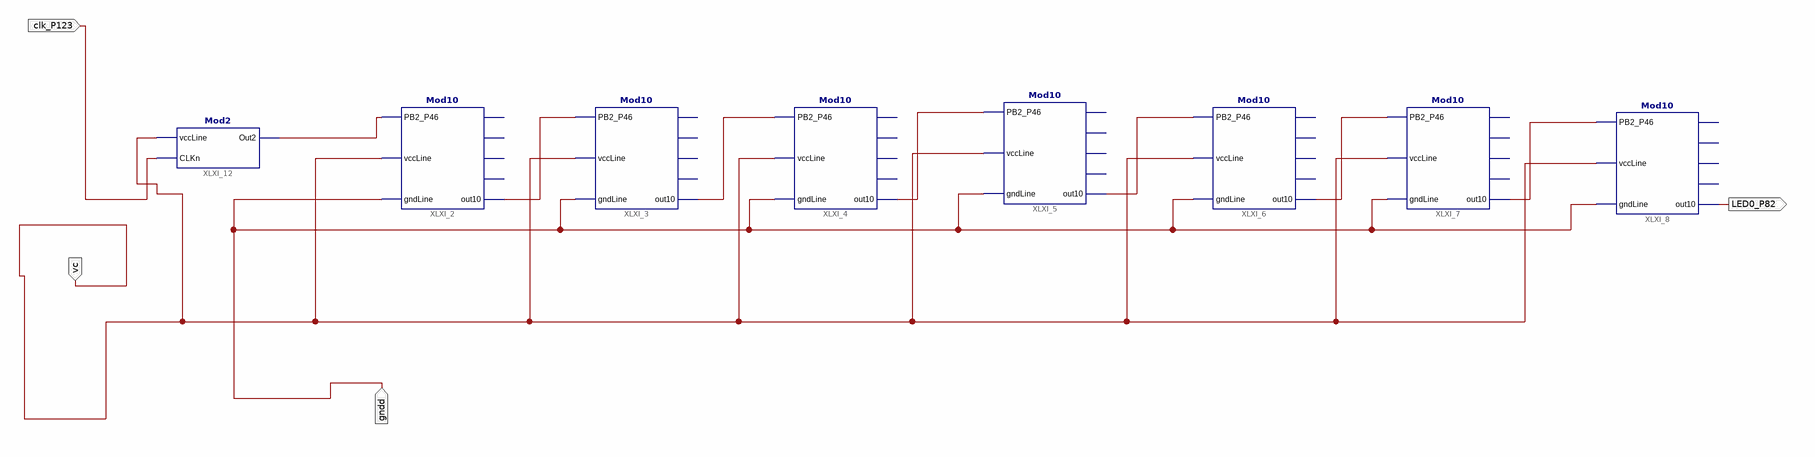
[diagram p0: schematic sheet 1]
// Xilinx ISE schematic time1s.sch (spartan6) as structural Verilog: 8 symbols, 4 ports
module time1s (
  input  gndd,
  input  clk_P123,
  input  vc,
  output LED0_P82
);

  wire XLXN_2, XLXN_3, XLXN_4, XLXN_5, XLXN_6, XLXN_7, XLXN_15;

  Mod10 XLXI_2 (.PB2_P46(XLXN_15), .vccLine(vc), .gndLine(gndd), .out10(XLXN_2));  // open: A, B, C, D
  Mod10 XLXI_3 (.PB2_P46(XLXN_2), .vccLine(vc), .gndLine(gndd), .out10(XLXN_3));  // open: A, B, C, D
  Mod10 XLXI_4 (.PB2_P46(XLXN_3), .vccLine(vc), .gndLine(gndd), .out10(XLXN_4));  // open: A, B, C, D
  Mod10 XLXI_5 (.PB2_P46(XLXN_4), .vccLine(vc), .gndLine(gndd), .out10(XLXN_5));  // open: A, B, C, D
  Mod10 XLXI_6 (.PB2_P46(XLXN_5), .vccLine(vc), .gndLine(gndd), .out10(XLXN_6));  // open: A, B, C, D
  Mod10 XLXI_7 (.PB2_P46(XLXN_6), .vccLine(vc), .gndLine(gndd), .out10(XLXN_7));  // open: A, B, C, D
  Mod10 XLXI_8 (.PB2_P46(XLXN_7), .vccLine(vc), .gndLine(gndd), .out10(LED0_P82));  // open: A, B, C, D
  Mod2 XLXI_12 (.vccLine(vc), .CLKn(clk_P123), .Out2(XLXN_15));
endmodule
